# EAGLE design Vulture Controls (EAGLE 6.5.0)

## Sheet 1 of 5: IC - Teensy 3.1
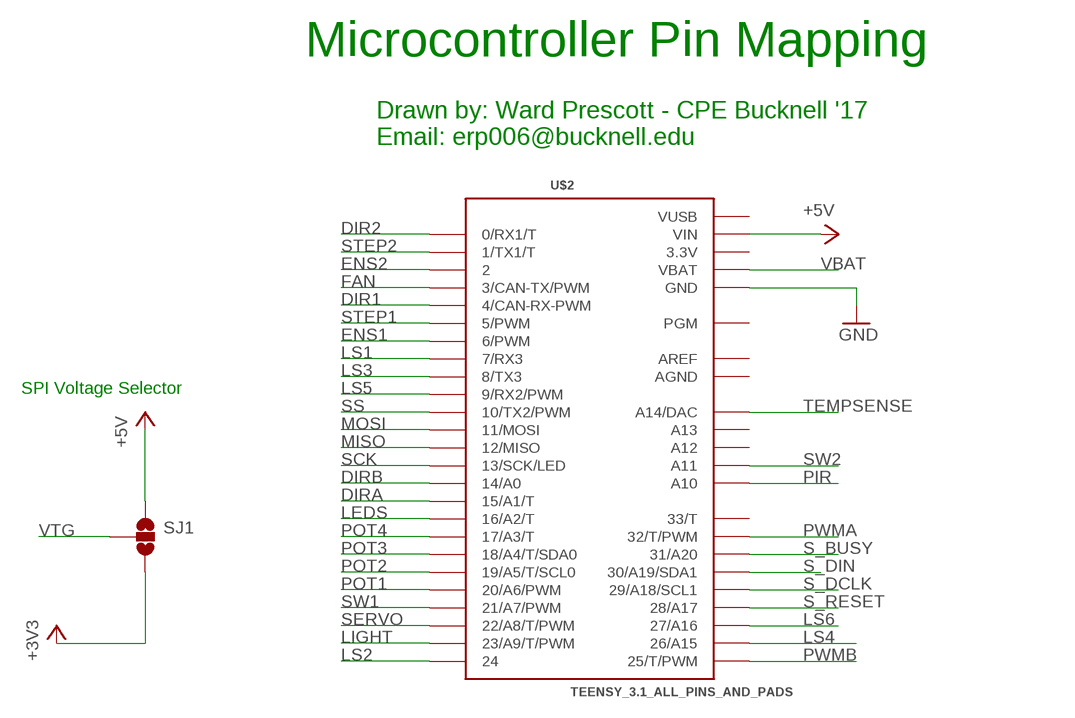
[diagram p0: schematic, sheet 1]

### Parts
SJ1  JUMPER-PAD-3-NOFULL_BOX_SILK  [PAD-JUMPER-3-NO_YES_SILK_FULL_BOX]
U$2  TEENSY_3.1_ALL_PINS_AND_PADS  [TEENSY_3.1_ALLPINS]

### Nets
+3V3: SJ1.3 ; also sheet 2,3,4
+5V: SJ1.1 U$2.VIN ; also sheet 3,4
DIR1: U$2.4(4/CAN-RX-PWM) ; also sheet 2
DIR2: U$2.0(0/RX1/T) ; also sheet 2
DIRA: U$2.15/A1(15/A1/T) ; also sheet 3
DIRB: U$2.14/A0 ; also sheet 3
ENS1: U$2.6(6/PWM) ; also sheet 2
ENS2: U$2.2 ; also sheet 2
FAN: U$2.3(3/CAN-TX/PWM) ; also sheet 4
GND: U$2.GND U$2.GND1(GND) U$2.GND2(GND) ; also sheet 2,3,4,5
LEDS: U$2.16/A2(16/A2/T) ; also sheet 4
LIGHT: U$2.23/A9(23/A9/T/PWM) ; also sheet 4
LS1: U$2.7(7/RX3) ; also sheet 4
LS2: U$2.24 ; also sheet 4
LS3: U$2.8(8/TX3) ; also sheet 4
LS4: U$2.26(26/A15) ; also sheet 4
LS5: U$2.9(9/RX2/PWM) ; also sheet 4
LS6: U$2.27(27/A16) ; also sheet 4
MISO: U$2.12(12/MISO) ; also sheet 4
MOSI: U$2.11(11/MOSI) ; also sheet 4
PIR: U$2.A10 ; also sheet 4
POT1: U$2.20/A6(20/A6/PWM) ; also sheet 4
POT2: U$2.19/A5(19/A5/T/SCL0) ; also sheet 4
POT3: U$2.18/A4(18/A4/T/SDA0) ; also sheet 4
POT4: U$2.17/A3(17/A3/T) ; also sheet 4
PWMA: U$2.32(32/T/PWM) ; also sheet 3
PWMB: U$2.25(25/T/PWM) ; also sheet 3
S_BUSY: U$2.31(31/A20) ; also sheet 4
S_DCLK: U$2.29(29/A18/SCL1) ; also sheet 4
S_DIN: U$2.30(30/A19/SDA1) ; also sheet 4
S_RESET: U$2.28(28/A17) ; also sheet 4
SCK: U$2.13(13/SCK/LED) ; also sheet 4
SERVO: U$2.22/A8(22/A8/T/PWM) ; also sheet 4
SS: U$2.10(10/TX2/PWM) ; also sheet 4
STEP1: U$2.5(5/PWM) ; also sheet 2
STEP2: U$2.1(1/TX1/T) ; also sheet 2
SW1: U$2.21/A7(21/A7/PWM) ; also sheet 4
SW2: U$2.A11 ; also sheet 4
TEMPSENSE: U$2.A14(A14/DAC) ; also sheet 4
VBAT: U$2.VBAT ; also sheet 4
VTG: SJ1.2 ; also sheet 4
Unconnected: U$2.33(33/T) U$2.A12 U$2.A13 U$2.PGM

### Notes on the sheet
- Microcontroller Pin Mapping
- Drawn by: Ward Prescott - CPE Bucknell '17
  Email: erp006@bucknell.edu
- SPI Voltage Selector

## Sheet 2 of 5: Stepper Motor Drive
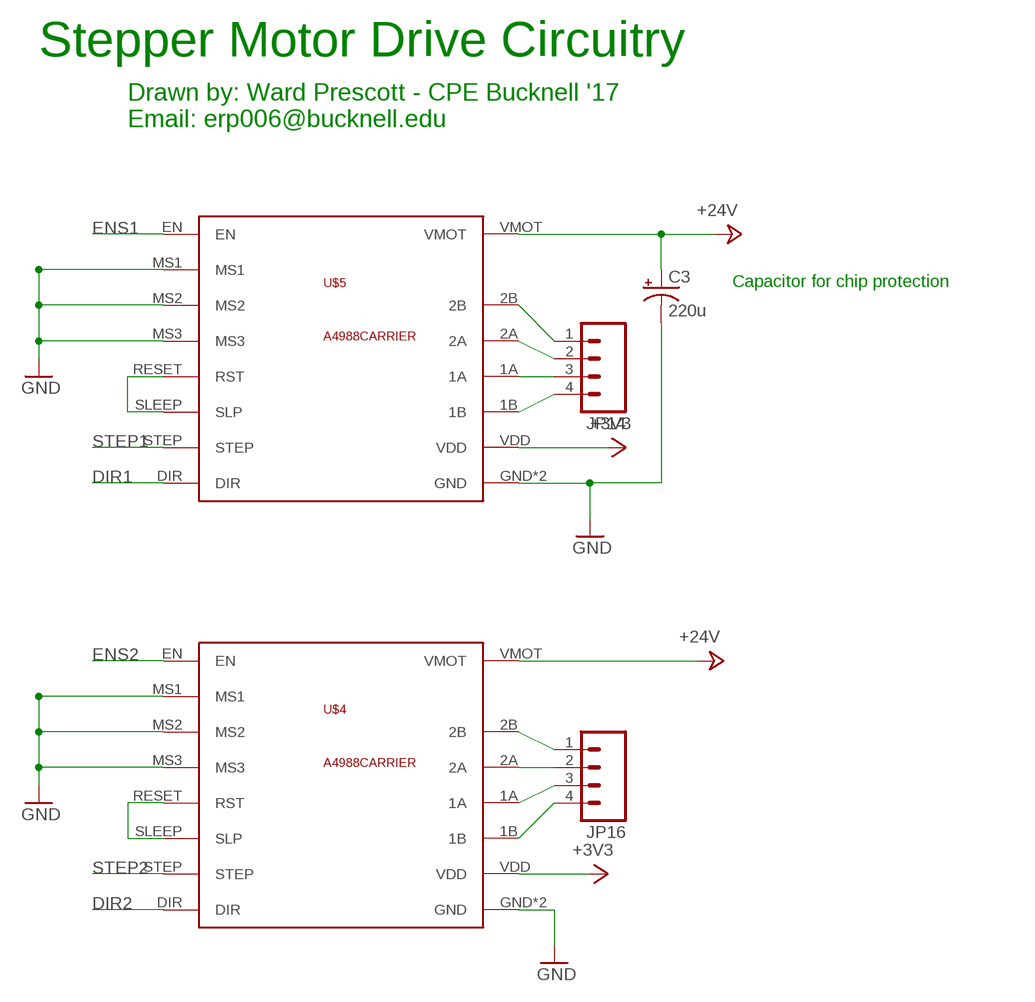
[diagram p1: schematic, sheet 2]

### Parts
C3  220u  CAP_POLPTH4  [CPOL-RADIAL-1000UF-25V]
JP14  M04POLAR_LOCK  [MOLEX-1X4_LOCK]
JP16  M04POLAR_LOCK  [MOLEX-1X4_LOCK]
U$4  A4988CARRIER  [A4988CARRIER]
U$5  A4988CARRIER  [A4988CARRIER]

### Nets
+3V3: U$4.VDD U$5.VDD ; also sheet 1,3,4
+24V: C3.+ U$4.VMOT U$5.VMOT ; also sheet 3,4
DIR1: U$5.DIR ; also sheet 1
DIR2: U$4.DIR ; also sheet 1
ENS1: U$5.EN ; also sheet 1
ENS2: U$4.EN ; also sheet 1
GND: C3.- U$4.GND U$4.GND2(GND) U$4.MS1 U$4.MS2 U$4.MS3 U$5.GND U$5.GND2(GND) U$5.MS1 U$5.MS2 U$5.MS3 ; also sheet 1,3,4,5
N$13: JP14.1 U$5.2B
N$14: JP14.2 U$5.2A
N$15: JP14.3 U$5.1A
N$16: JP14.4 U$5.1B
N$17: JP16.1 U$4.2B
N$18: JP16.2 U$4.2A
N$19: JP16.3 U$4.1A
N$20: JP16.4 U$4.1B
N$23: U$5.RESET(RST) U$5.SLEEP(SLP)
N$24: U$4.RESET(RST) U$4.SLEEP(SLP)
STEP1: U$5.STEP ; also sheet 1
STEP2: U$4.STEP ; also sheet 1

### Notes on the sheet
- Stepper Motor Drive Circuitry
- Drawn by: Ward Prescott - CPE Bucknell '17
  Email: erp006@bucknell.edu
- Capacitor for chip protection

## Sheet 3 of 5: DC Motor Control
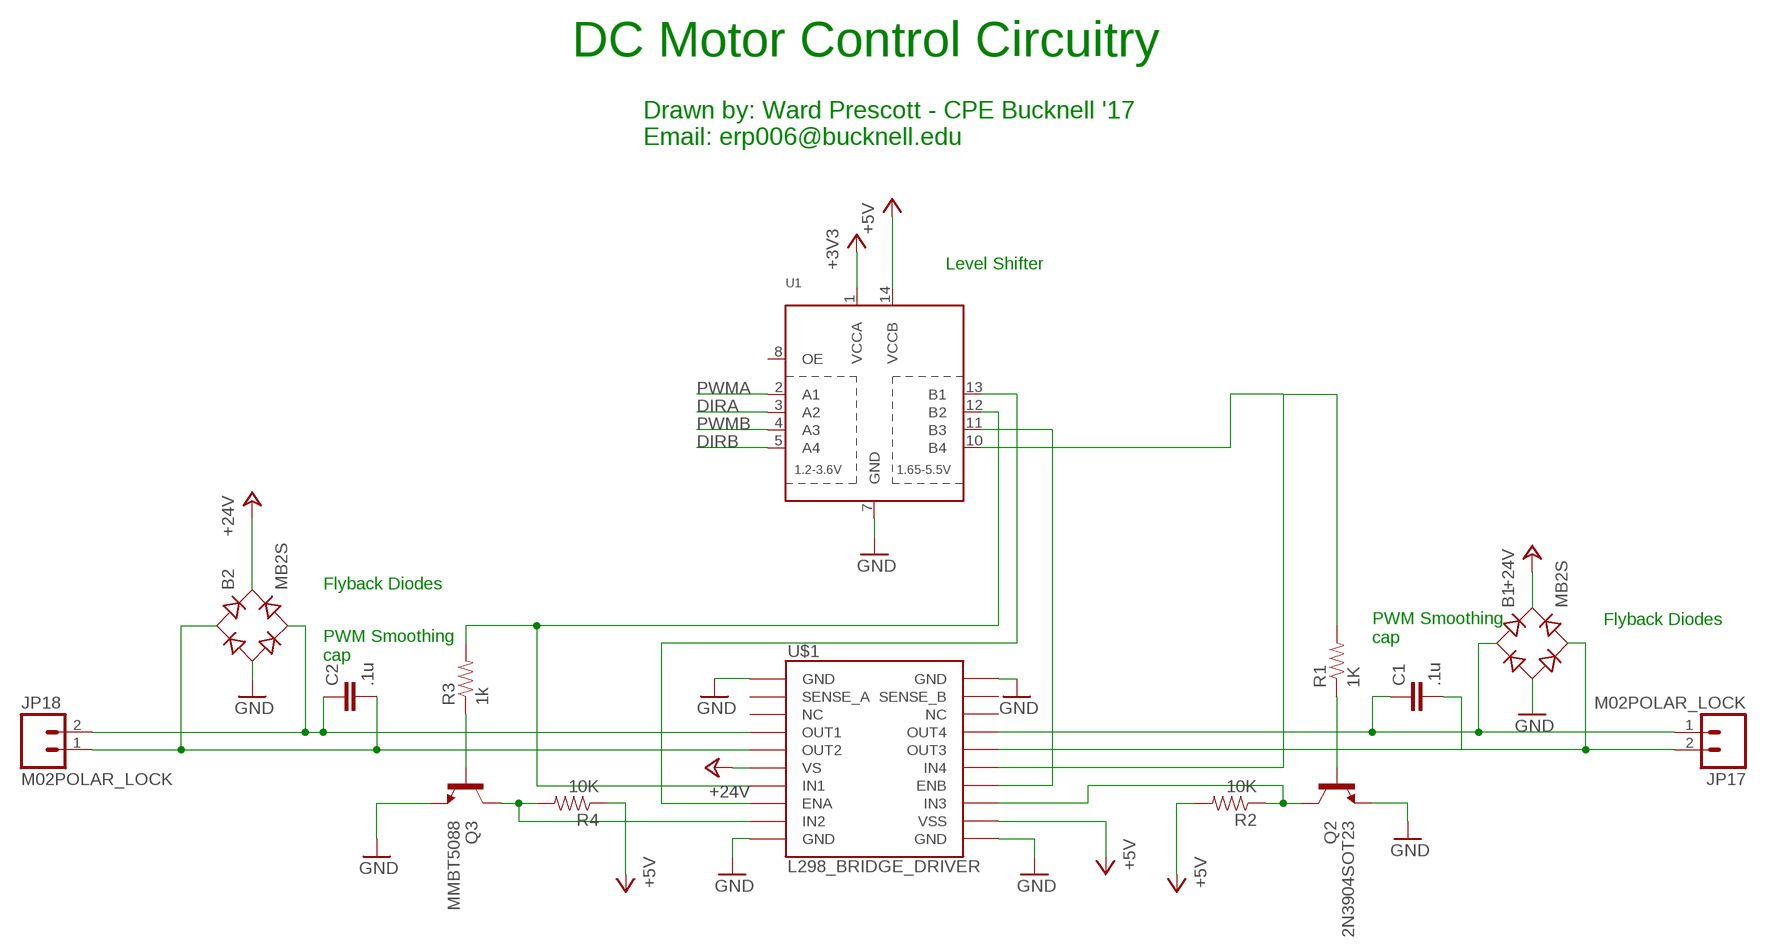
[diagram p2: schematic, sheet 3]

### Parts
B1  MB2S  [SOIC-4]
B2  MB2S  [SOIC-4]
C1  .1u  CAP1210  [1210]
C2  .1u  CAP1210  [1210]
JP17  M02POLAR_LOCK  [MOLEX-1X2_LOCK]
JP18  M02POLAR_LOCK  [MOLEX-1X2_LOCK]
Q2  2N3904SOT23  TRANSISTOR_NPNMMBT5088  [SOT23]
Q3  MMBT5088  TRANSISTOR_NPNMMBT5088  [SOT23]
R1  1K  RESISTOR0805-RES  [0805]
R2  10K  RESISTOR0603  [0603-RES]
R3  1k  RESISTOR0805-RES  [0805]
R4  10K  RESISTOR0603  [0603-RES]
U1  TXB0104PWRSOIC14  [SO14]
U$1  L298_BRIDGE_DRIVER  [POWERSO20]

### Nets
+3V3: U1.1(VCCA) ; also sheet 1,2,4
+5V: R2.2 R4.1 U1.14(VCCB) U$1.12(VSS) ; also sheet 1,4
+24V: B1.+ B2.+ U$1.6(VS) ; also sheet 2,4
DIRA: U1.3(A2) ; also sheet 1
DIRB: U1.5(A4) ; also sheet 1
GND: B1.- B2.- Q2.2(E) Q3.2(E) U1.7(GND) U$1.1(GND) U$1.10(GND) U$1.11(GND) U$1.20(GND) U$1.P$1(GND) ; also sheet 1,2,4,5
N$1: B2.~2(AC2) C2.1 JP18.2 U$1.4(OUT1)
N$2: B2.~1(AC1) C2.2 JP18.1 U$1.5(OUT2)
N$3: B1.~1(AC1) C1.1 JP17.1 U$1.17(OUT4)
N$4: B1.~2(AC2) C1.2 JP17.2 U$1.16(OUT3)
N$5: U1.11(B3) U$1.14(ENB)
N$6: R1.2 U1.10(B4) U$1.15(IN4)
N$7: U1.13(B1) U$1.8(ENA)
N$8: R3.2 U1.12(B2) U$1.7(IN1)
N$9: Q2.1(B) R1.1
N$10: Q2.3(C) R2.1 U$1.13(IN3)
N$11: Q3.1(B) R3.1
N$12: Q3.3(C) R4.2 U$1.9(IN2)
PWMA: U1.2(A1) ; also sheet 1
PWMB: U1.4(A3) ; also sheet 1
Unconnected: U1.8(OE) U$1.2(SENSE_A) U$1.3(NC) U$1.18(NC) U$1.19(SENSE_B)

### Notes on the sheet
- DC Motor Control Circuitry
- Drawn by: Ward Prescott - CPE Bucknell '17
  Email: erp006@bucknell.edu
- Level Shifter
- Flyback Diodes
- Flyback Diodes
- PWM Smoothing
  cap
- PWM Smoothing
  cap

## Sheet 4 of 5: Other Peripherals
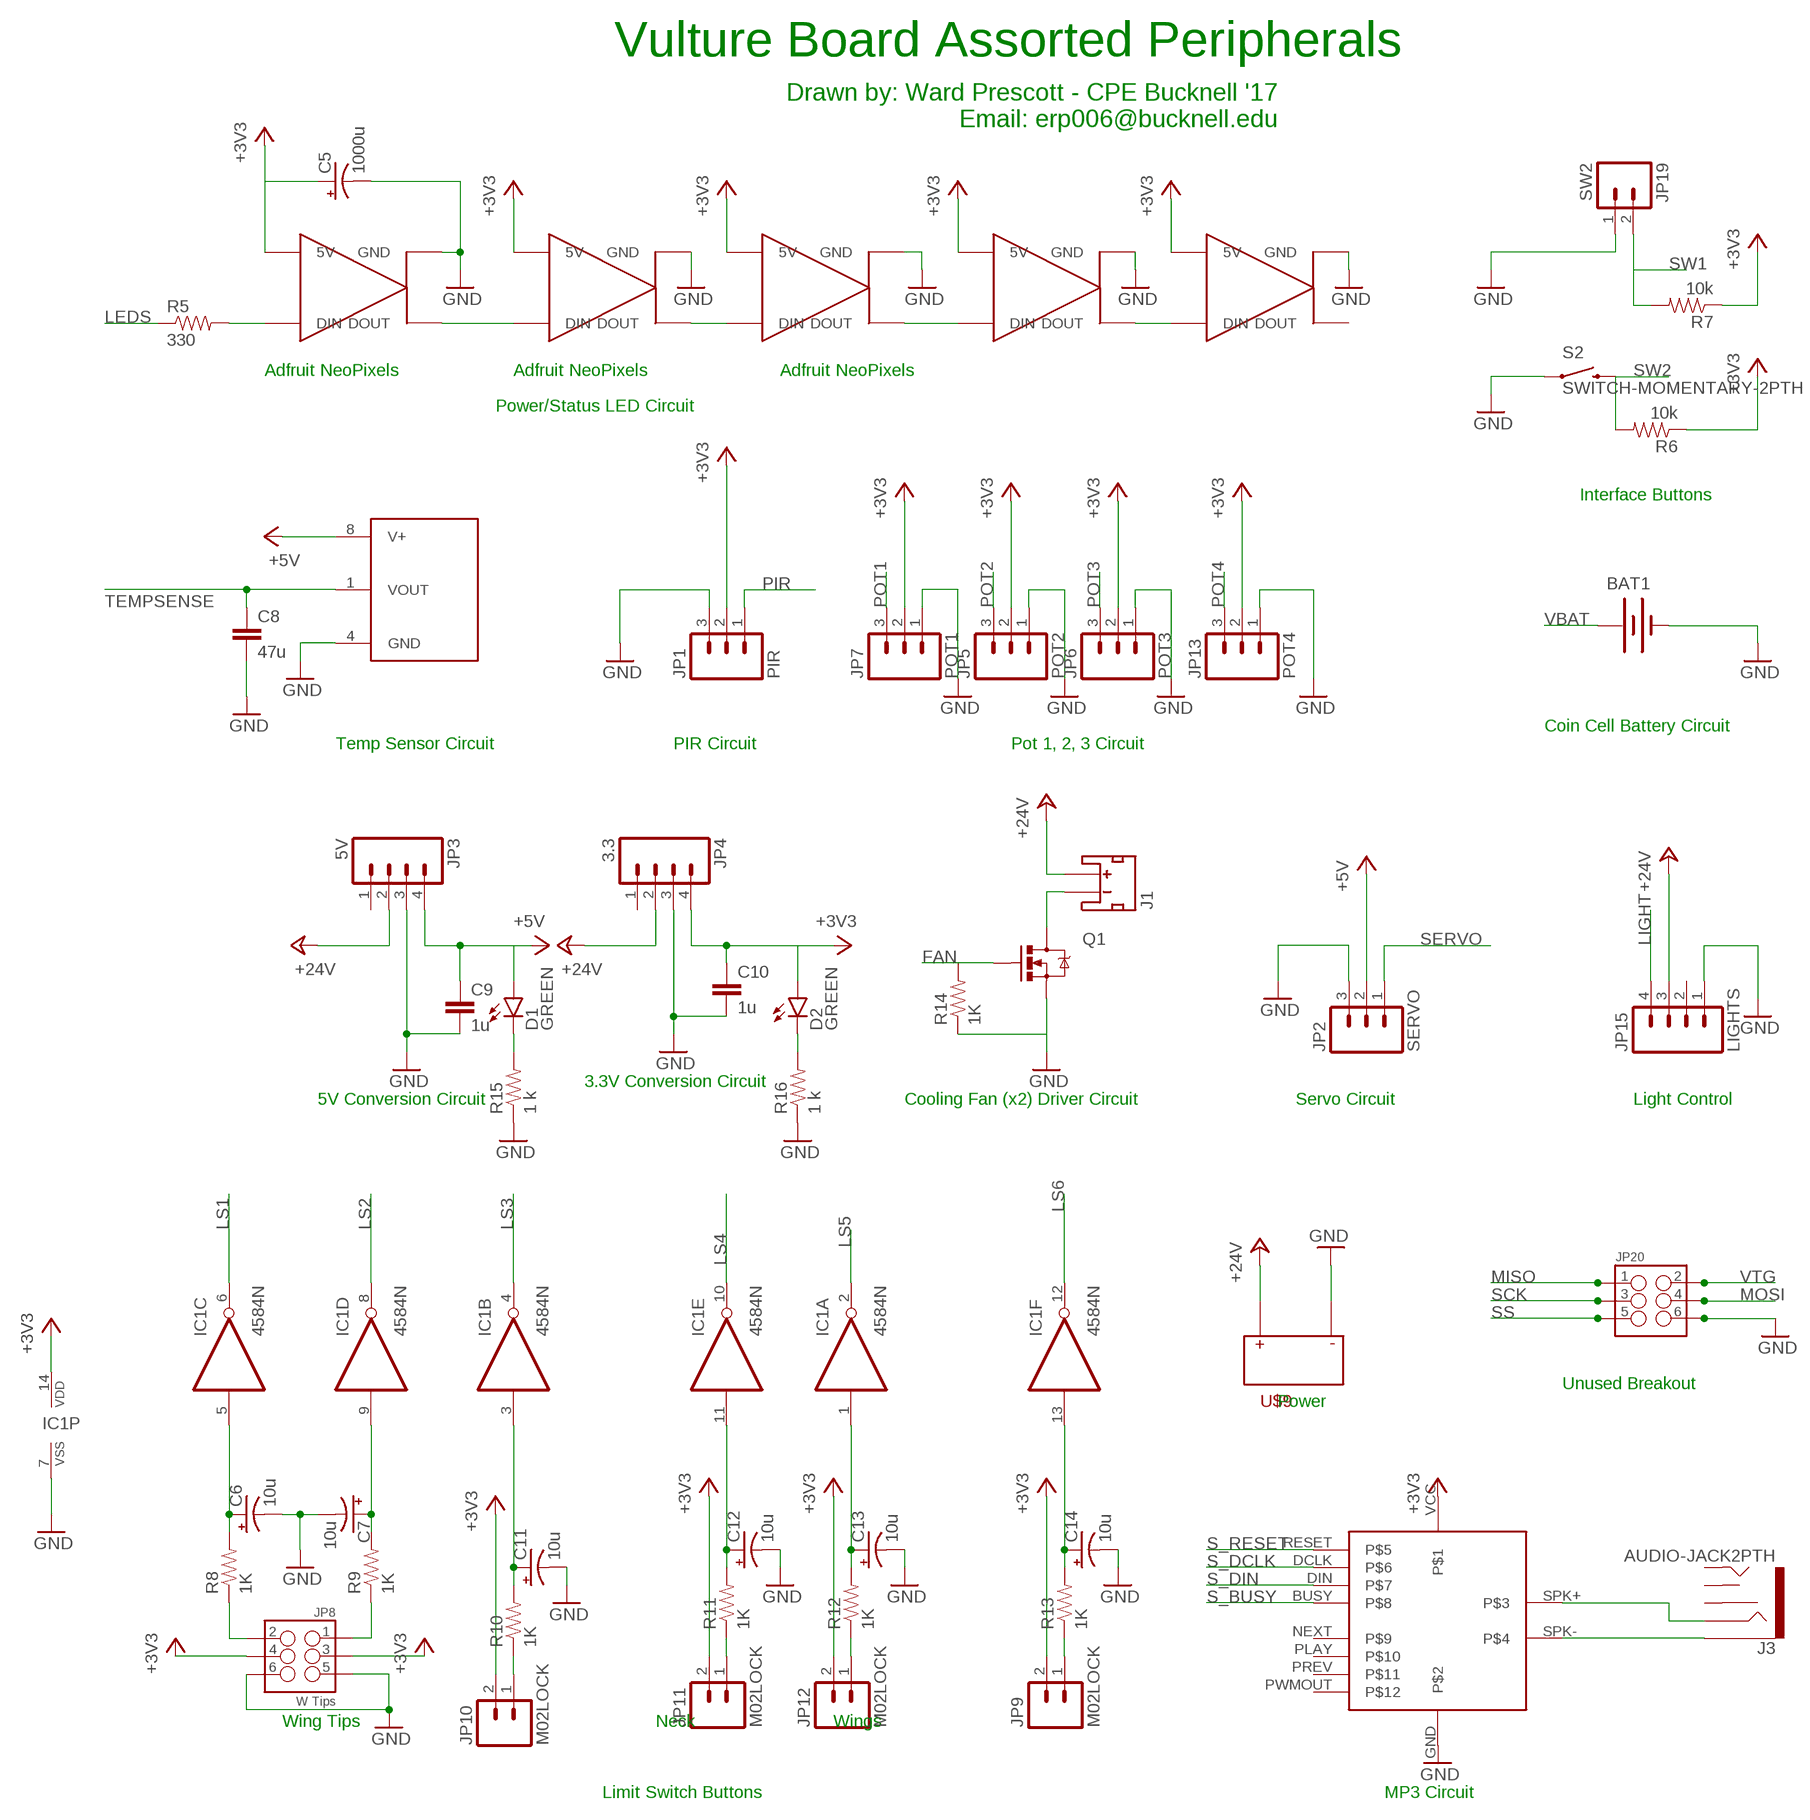
[diagram p3: schematic, sheet 4]

### Parts
BAT1  BATTERY20PTH  [BATTCOM_20MM_PTH]
C5  1000u  CAP_POLG  [PANASONIC_G]
C6  10u  CAP_POLC  [PANASONIC_C]
C7  10u  CAP_POLC  [PANASONIC_C]
C8  47u  CAP1206  [1206]
C9  1u  CAP1206  [1206]
C10  1u  CAP1206  [1206]
C11  10u  CAP_POLC  [PANASONIC_C]
C12  10u  CAP_POLC  [PANASONIC_C]
C13  10u  CAP_POLC  [PANASONIC_C]
C14  10u  CAP_POLC  [PANASONIC_C]
D1  GREEN  LED-GREENLARGE  [LED-1206]
D2  GREEN  LED-GREENLARGE  [LED-1206]
IC1  4584N  [DIL14]
J1  JST_2MM_MALE  [JST-2-SMD]
J3  AUDIO-JACK2PTH  [AUDIO-JACK]
JP1  PIR  M03LOCK_LONGPADS  [1X03_LOCK_LONGPADS]
JP2  SERVO  M03LOCK_LONGPADS  [1X03_LOCK_LONGPADS]
JP3  5V  M04LOCK  [1X04_LOCK]
JP4  3.3  M04LOCK  [1X04_LOCK]
JP5  POT2  M03LOCK_LONGPADS  [1X03_LOCK_LONGPADS]
JP6  POT3  M03LOCK_LONGPADS  [1X03_LOCK_LONGPADS]
JP7  POT1  M03LOCK_LONGPADS  [1X03_LOCK_LONGPADS]
JP8  W Tips  M03X2POGO_PINS  [2X3_POGO]
JP9  M02LOCK  [1X02_LOCK]
JP10  M02LOCK  [1X02_LOCK]
JP11  M02LOCK  [1X02_LOCK]
JP12  M02LOCK  [1X02_LOCK]
JP13  POT4  M03LOCK_LONGPADS  [1X03_LOCK_LONGPADS]
JP15  LIGHTS  M04POLAR_LOCK  [MOLEX-1X4_LOCK]
JP19  SW2  M02LOCK  [1X02_LOCK]
JP20  M03X2POGO_PINS  [2X3_POGO]
Q1  SSM3K329R,LF  MOSFET-NCHANNEL2N7002PW  [SOT323]
R5  330  RESISTOR0603  [0603-RES]
R6  10k  RESISTOR0603  [0603-RES]
R7  10k  RESISTOR0603  [0603-RES]
R8  1K  RESISTOR0805-RES  [0805]
R9  1K  RESISTOR0805-RES  [0805]
R10  1K  RESISTOR0805-RES  [0805]
R11  1K  RESISTOR0805-RES  [0805]
R12  1K  RESISTOR0805-RES  [0805]
R13  1K  RESISTOR0805-RES  [0805]
R14  1K  RESISTOR0805-RES  [0805]
R15  1 k  RESISTOR0805-RES  [0805]
R16  1 k  RESISTOR0805-RES  [0805]
S2  SWITCH-MOMENTARY-2PTH  [TACTILE-PTH]
U$3  LM34  [SO08]
U$6  NEOPIXEL_THT  [NEOPIXEL_THT]
U$7  NEOPIXEL_THT  [NEOPIXEL_THT]
U$8  NEOPIXEL_THT  [NEOPIXEL_THT]
U$9  CONN_HDR_2POS_7.5MM_R/A_SLDR  [MOLEXPOWER]
U$10  NEOPIXEL_THT  [NEOPIXEL_THT]
U$11  NEOPIXEL_THT  [NEOPIXEL_THT]
U$12  WTV020SD-BRKOUT  [WTVO20SD-BRKKOUT]

### Nets
+3V3: C5.+ C10.1 D2.A IC1.14(P:VDD) JP1.2 JP4.4 JP5.2 JP6.2 JP7.2 JP8.P$3 JP8.P$4 JP9.2 JP10.2 JP11.2 JP12.2 JP13.2 R6.1 R7.1 U$6.5V U$7.5V U$8.5V U$10.5V U$11.5V U$12.VCC ; also sheet 1,2,3
+5V: C9.1 D1.A JP2.2 JP3.4 U$3.8(V+) ; also sheet 1,3
+24V: J1.2(+) JP3.2 JP4.2 JP15.3 U$9.P$1 U$9.P$2 ; also sheet 2,3
FAN: Q1.1(G) R14.2 ; also sheet 1
GND: BAT1.2(-) C5.- C6.- C7.- C8.2 C9.2 C10.2 C11.- C12.- C13.- C14.- IC1.7(P:VSS) JP1.3 JP2.3 JP3.3 JP4.3 JP5.1 JP6.1 JP7.1 JP8.P$5 JP8.P$6 JP13.1 JP15.1 JP19.1 JP20.P$6 Q1.2(S) R14.1 R15.1 R16.1 S2.1 U$3.4(GND) U$6.GND U$7.GND U$8.GND U$9.P$3 U$9.P$4 U$10.GND U$11.GND U$12.GND ; also sheet 1,2,3,5
LEDS: R5.1 ; also sheet 1
LIGHT: JP15.4 ; also sheet 1
LS1: IC1.6(C:O) ; also sheet 1
LS2: IC1.8(D:O) ; also sheet 1
LS3: IC1.4(B:O) ; also sheet 1
LS4: IC1.10(E:O) ; also sheet 1
LS5: IC1.2(A:O) ; also sheet 1
LS6: IC1.12(F:O) ; also sheet 1
MISO: JP20.P$1 ; also sheet 1
MOSI: JP20.P$4 ; also sheet 1
N1: C6.+ IC1.5(C:I) R8.2
N2: C7.+ IC1.9(D:I) R9.2
N3: C11.+ IC1.3(B:I) R10.2
N5: C13.+ IC1.1(A:I) R12.2
N6: C14.+ IC1.13(F:I) R13.2
N$21: C12.+ IC1.11(E:I) R11.2
N$22: JP10.1 R10.1
N$25: JP11.1 R11.1
N$27: JP12.1 R12.1
N$29: U$6.DOUT U$7.DIN
N$30: U$8.DOUT U$10.DIN
N$31: R5.2 U$6.DIN
N$32: U$7.DOUT U$8.DIN
N$33: J1.1(-) Q1.3(D)
N$34: JP8.P$2 R8.1
N$35: JP8.P$1 R9.1
N$36: JP9.1 R13.1
N$38: U$10.DOUT U$11.DIN
N$39: J3.SLEEVE U$12.SPK-
N$40: J3.RING U$12.SPK+
N$49: D1.C R15.2
N$50: D2.C R16.2
PIR: JP1.1 ; also sheet 1
POT1: JP7.3 ; also sheet 1
POT2: JP5.3 ; also sheet 1
POT3: JP6.3 ; also sheet 1
POT4: JP13.3 ; also sheet 1
S_BUSY: U$12.BUSY ; also sheet 1
S_DCLK: U$12.DCLK ; also sheet 1
S_DIN: U$12.DIN ; also sheet 1
S_RESET: U$12.RESET ; also sheet 1
SCK: JP20.P$3 ; also sheet 1
SERVO: JP2.1 ; also sheet 1
SS: JP20.P$5 ; also sheet 1
SW1: JP19.2 R7.2 ; also sheet 1
SW2: R6.2 S2.3 ; also sheet 1
TEMPSENSE: C8.1 U$3.1(VOUT) ; also sheet 1
VBAT: BAT1.1(+) ; also sheet 1
VTG: JP20.P$2 ; also sheet 1
Unconnected: J1.NC1(PAD1) J1.NC2(PAD2) J3.RSH J3.TIP J3.TSH JP3.1 JP4.1 JP15.2 U$11.DOUT U$12.NEXT U$12.PLAY U$12.PREV U$12.PWMOUT

### Notes on the sheet
- Vulture Board Assorted Peripherals
- Drawn by: Ward Prescott - CPE Bucknell '17
  Email: erp006@bucknell.edu
- Adfruit NeoPixels | Adfruit NeoPixels | Adfruit NeoPixels
- Power/Status LED Circuit
- Interface Buttons
- Coin Cell Battery Circuit
- Temp Sensor Circuit | PIR Circuit | Pot 1, 2, 3 Circuit
- 3.3V Conversion Circuit
- 5V Conversion Circuit | Cooling Fan (x2) Driver Circuit | Servo Circuit | Light Control
- Unused Breakout
- Power
- Wing Tips | Neck | Wings
- Limit Switch Buttons | MP3 Circuit

## Sheet 5 of 5: Holes and Misc.
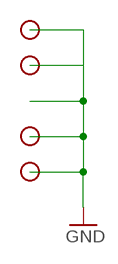
[diagram p4: schematic, sheet 5]

### Parts
STANDOFF1  STAND-OFF  [STAND-OFF]
STANDOFF2  STAND-OFF  [STAND-OFF]
STANDOFF4  STAND-OFF  [STAND-OFF]
STANDOFF6  STAND-OFF  [STAND-OFF]

## Power pins joined to a net without a drawn wire
3.3V: U$2.3.3V U$2.3.3V1(3.3V) U$2.3.3V2(3.3V)
AGND: U$2.AGND
AREF: U$2.AREF
VUSB: U$2.VUSB

## Library data of the parts
B1 B2 = rectifier:MB*S: Bridge Rectifier Source: http://www.fairchildsemi.com/ds/MB/MB6S.pdf
BAT1 = SparkFun-Electromechanical:BATTERY: Battery Holders Various common sizes : AA, AAA, 20mm coin cell and 12mm coin cell. 20MM_4LEGS, BATT-10373
C1 C2 C8-C10 = SparkFun-Capacitors:CAP: Capacitor Standard 0603 ceramic capacitor, and 0.1" leaded capacitor.
C3 C5-C7 C11-C14 = SparkFun-Capacitors:CAP_POL: Capacitor Polarized These are standard SMD and PTH capacitors. Normally 10uF, 47uF, and 100uF in electrolytic and tantalum varieties. Always verify the external diameter of the through hole cap, it varies with capacity, voltage, and manufacturer. The EIA devices should be standard.
D1 D2 = SparkFun-LED:LED-GREEN: Various green LEDs Green LEDs used in SFE Production 0603- DIO-00821 LARGE- DIO-00862 LILYPAD- DIO-09910; PROD_ID: DIO-00862
IC1 = 45xx:4584: Hex SCHMITT TRIGGER (74C14)
J1 = SparkFun-Connectors:JST_2MM_MALE: Mates to single-cell LiPo batteries. CONN-08352; PROD_ID: CONN-08352
J3 = SparkFun-Connectors:AUDIO-JACK2: Stereo audio jack with bypass switches. SMT version used on LilyPad MP3 board.; PROD_ID: CONN-08774
JP1 JP2 JP5-JP7 JP13 = SparkFun-Connectors:M03: Header 3 Standard 3-pin 0.1" header. Use with straight break away headers (SKU : PRT-00116), right angle break away headers (PRT-00553), swiss pins (PRT-00743), machine pins (PRT-00117), and female headers (PRT-00115). Molex polarized connector foot print use with SKU : PRT-08232 with associated crimp pins and housings.
JP3 JP4 JP14-JP16 = SparkFun-Connectors:M04: Header 4 Standard 4-pin 0.1" header. Use with straight break away headers (SKU : PRT-00116), right angle break away headers (PRT-00553), swiss pins (PRT-00743), machine pins (PRT-00117), and female headers (PRT-00115). Molex polarized connector foot print use with SKU : PRT-08231 with associated crimp pins and housings. 1MM SMD Version SKU: PRT-10208
JP8 JP20 = SparkFun-Connectors:M03X2: 2x3 .1" header. Shrouded, with keying- CONN-10681 SMT- CONN-11415 Pogo pins- HW-11044; PROD_ID: HW-11044
JP9-JP12 JP17-JP19 = SparkFun-Connectors:M02: Standard 2-pin 0.1" header. Use with - straight break away headers ( PRT-00116) - right angle break away headers (PRT-00553) - swiss pins (PRT-00743) - machine pins (PRT-00117) - female headers (PRT-00115) Molex polarized connector foot print use with: PRT-08233 with associated crimp pins and housings. 2.54_SCREWTERM for use with PRT-10571. 3.5mm Screw Terminal footprints for PRT-08084 5mm Screw Terminal footprints for use with PRT-08432
Q1 = SparkFun-DiscreteSemi:MOSFET-NCHANNEL: Common NMOSFET Parts MFG P/N Store ID Prod ID FDD8780 TRANS-09984 SI7820DN TRANS-11055 FDS6630A IC-08089 2N7002PW TRANS-11151 FQP30N06L COM-10213 TRANS-10060 BSS123LT1G TRANS-08345 BSS138 TRANS-00830 BS170 2N7000; PROD_ID: TRANS-11151
Q2 = SparkFun-DiscreteSemi:TRANSISTOR_NPN: Generic NPN BJT MMBT2222A - TRANS-08049 (SOT-23, 1A 40V) MPSA42 - TRANS-09116 (SOT-23, 500mA 300V) MMBT5088LT1G - TRANS-11160 (SOT-23, 50 mA 30V) BC547 - COM-08928 <http://www.sparkfun.com/products/8928> (TO-92 45V 100mA) (1.Collector 2.Base 3.Emitter) 2N3904 - COM-00521 <http://www.sparkfun.com/products/521> (TO-92 40V 200mA) (1.Emitter 2.Base 3.Collector) P2N2222A - COM-12852 <http://www.sparkfun.com/products/12852> (TO-92 40V 600mA) (1.Collector 2.Base 3.Emitter); PROD_ID: TRANS-11160; VALUE: MMBT5088
Q3 = SparkFun-DiscreteSemi:TRANSISTOR_NPN: Generic NPN BJT MMBT2222A - TRANS-08049 (SOT-23, 1A 40V) MPSA42 - TRANS-09116 (SOT-23, 500mA 300V) MMBT5088LT1G - TRANS-11160 (SOT-23, 50 mA 30V) BC547 - COM-08928 <http://www.sparkfun.com/products/8928> (TO-92 45V 100mA) (1.Collector 2.Base 3.Emitter) 2N3904 - COM-00521 <http://www.sparkfun.com/products/521> (TO-92 40V 200mA) (1.Emitter 2.Base 3.Collector) P2N2222A - COM-12852 <http://www.sparkfun.com/products/12852> (TO-92 40V 600mA) (1.Collector 2.Base 3.Emitter); PROD_ID: TRANS-11160
R1-R16 = SparkFun-Resistors:RESISTOR: Resistor Basic schematic elements and footprints for 0603, 1206, and PTH resistors.
S2 = SparkFun-Electromechanical:SWITCH-MOMENTARY-2: Various NO switches- pushbuttons, reed, etc
SJ1 = SparkFun-Passives:JUMPER-PAD-3-NO
STANDOFF1 STANDOFF2 STANDOFF4 STANDOFF6 = SparkFun-Electromechanical:STAND-OFF: #4 Stand Off This is the mechanical footprint for a #4 phillips button head screw. Use the keepout ring to avoid running the screw head into surrounding components. SKU : PRT-00447
U1 = SparkFun-DigitalIC:TXB0104PWR: 4-Bit Bi-Directional Level Shifter 1.2V-3.6V (VCCA) to 1.65V-5.5V (VCCB) bi-directional level shifter with auto direction sensing. Max data rate - VCCA 1.8V: 20Mbps (50ns), VCCA 3.3V: 100Mbps (10ns) Digikey: 296-21929-1-ND (TSSOP) IC-11329; PROD_ID: IC-11329
U$1 = SparkFun-PowerIC:L298_BRIDGE_DRIVER: Full-bridge power driver IC
U$2 = Teensy_3_Series_Board_v1.0:TEENSY_3.1_ALL_PINS_AND_PADS: Footprint for Teensy 3.1 board using all pads and all through-holes. Pads need a 2x7 0.1" SMD header.
U$3 = SparkFun-Sensors:LM34: 10mV/degF, 1 degF accurate analog temp sensor
U$4 U$5 = Ward Custom:A4988CARRIER
U$6-U$8 U$10 U$11 = Ward Custom:NEOPIXEL_THT
U$9 = Ward Custom:CONN_HDR_2POS_7.5MM_R/A_SLDR
U$12 = Ward Custom:WTV020SD-BRKOUT

## Board
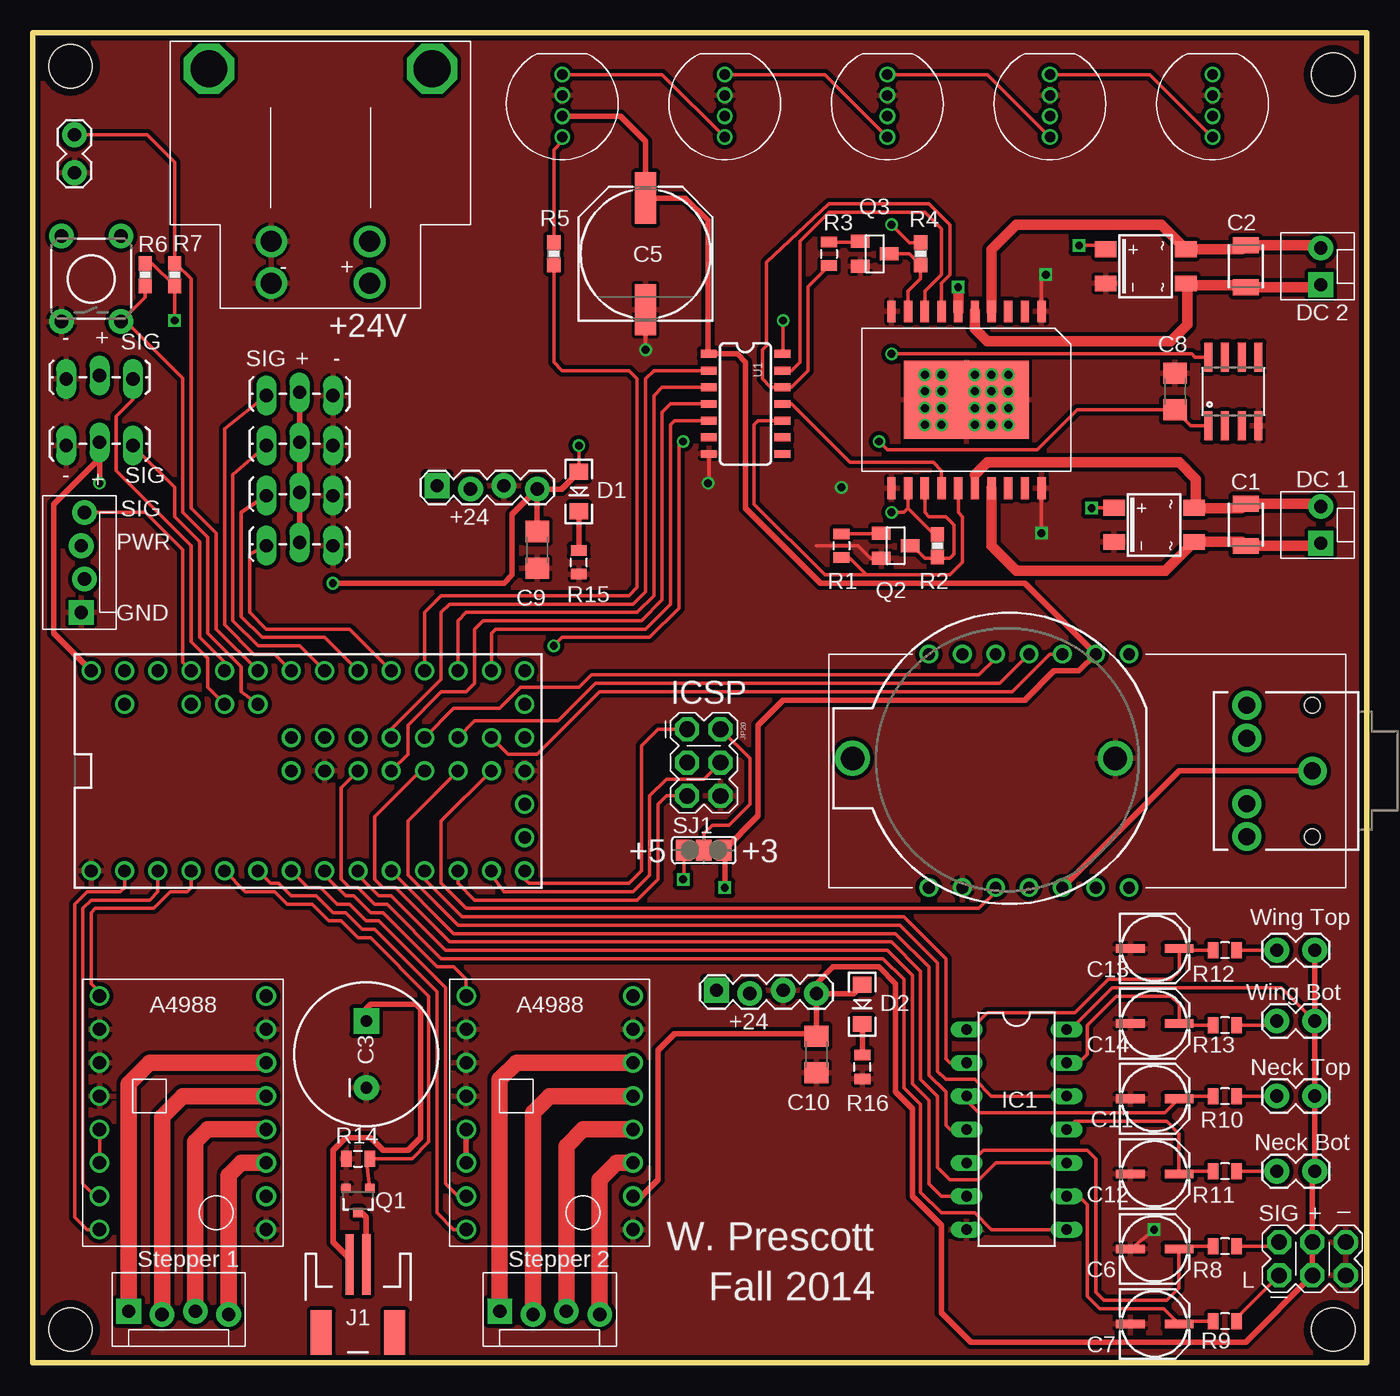
[diagram p5: board, top side]
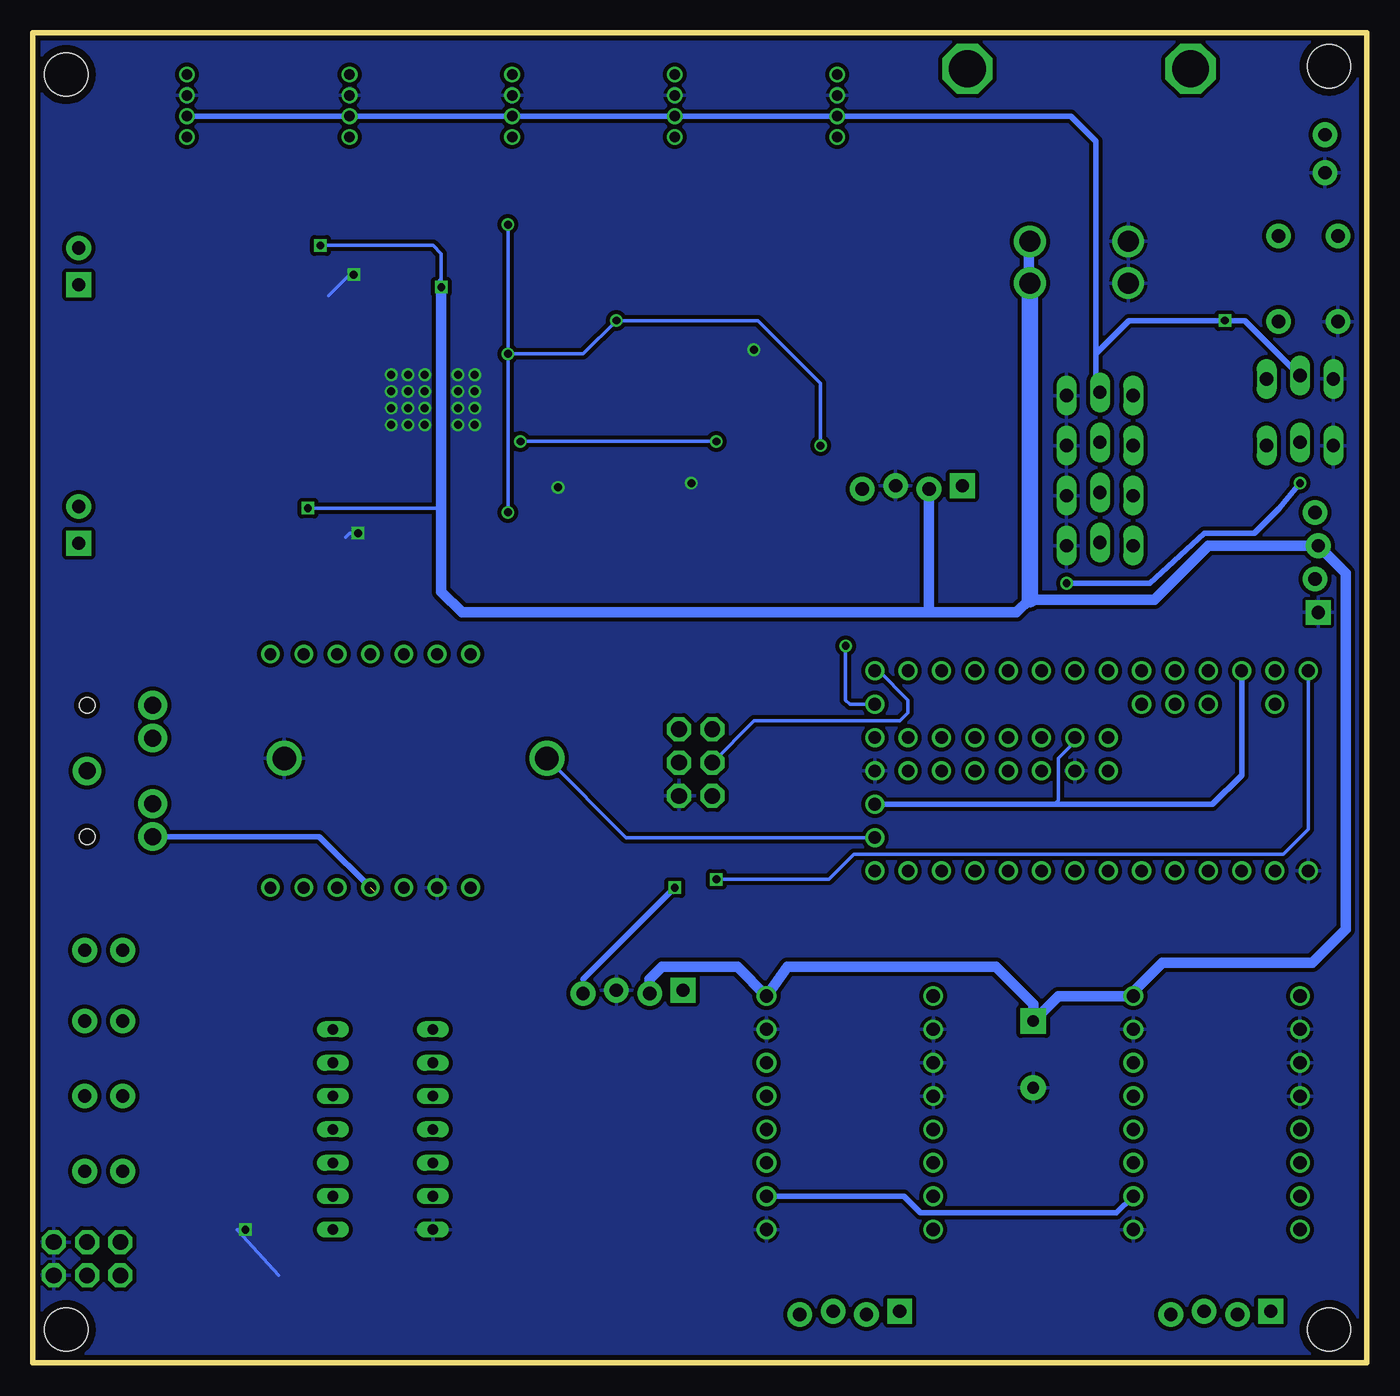
[diagram p6: board, bottom side, seen from below]

Size 101.6 x 101.28 mm. Coordinates in mm from the lower left corner, seen from the top.
Outline: 0,0 101.6,0 101.6,101.28 0,101.28 0,0
Copper layers (1*16): Top 0.0356mm / dielectric 1.5011mm / Bottom 0.0356mm
Design rules "OSHParkRules": minimum track width 6mil, minimum drill 13mil, track to track 6mil, track to pad 6mil, pad to pad 6mil, via to via 6mil, smd to smd 6mil, copper to edge 15mil, drill to drill 6mil, minimum pad ring 7mil, minimum via ring 7mil, stop-mask expansion 3mil, vias tented up to drill 0mil, thermal gap 10mil

### Footprints (pad centres in the part's own frame; a part is rotated, then mirrored left to right if it is on the bottom)
SOIC-4 = smd 1.2 x 1.651: + 1.3,3.05; - -1.3,3.05; ~1 -1.3,-3.05; ~2 1.3,-3.05
BATTCOM_20MM_PTH = drill 1.778: 1 11.85,0; 2 -8.15,0
1210 = smd 1.2 x 2: 1 -1.6,0; 2 1.6,0
CPOL-RADIAL-1000UF-25V = drill 0.9 pad 1.93 square: + 2.54,0 | drill 0.9 pad 1.93: - -2.54,0
PANASONIC_G = smd 3.9 x 1.6: + 4.25,0; - -4.25,0
PANASONIC_C = smd 2.2 x 0.65: + 1.9,-0.2; - -1.8,-0.2
1206 = smd 1.6 x 1.8: 1 -1.4,0; 2 1.4,0
LED-1206 = smd 1.2 x 1.4: A -1.5,0; C 1.5,0
DIL14 = drill 0.813 long: 1 -7.62,-3.81; 2 -5.08,-3.81; 3 -2.54,-3.81; 4 0,-3.81; 5 2.54,-3.81; 6 5.08,-3.81; 7 7.62,-3.81; 8 7.62,3.81; 9 5.08,3.81; 10 2.54,3.81; 11 0,3.81; 12 -2.54,3.81; 13 -5.08,3.81; 14 -7.62,3.81
JST-2-SMD = smd 0.635 x 4.6: 1 -0.635,-3.7; 2 0.635,-3.7 | smd 1.6 x 3.4: NC1 -2.794,1.5; NC2 2.794,1.5
AUDIO-JACK = drill 1.3 pad 2.184: RING 5,5; RSH 5,2.5; SLEEVE 0,0; TIP 5,-5; TSH 5,-2.5 | hole 1.2: 0,5; 0,-5
1X03_LOCK_LONGPADS = drill 1.016 long: 1 0,0; 2 2.54,-0.254; 3 5.08,0
1X04_LOCK = drill 1.016 pad 1.88 square: 1 0,0.127 | drill 1.016 pad 1.88: 2 2.54,-0.127; 3 5.08,0.127; 4 7.62,-0.127
2X3_POGO = drill 1.2 pad 1.829 octagon: P$1 0,0; P$2 0,2.54; P$3 2.54,0; P$4 2.54,2.54; P$5 5.08,0; P$6 5.08,2.54
1X02_LOCK = drill 1.016 pad 1.88: 1 -0.178,0; 2 2.718,0
MOLEX-1X4_LOCK = drill 1.016 pad 1.88 square: 1 0,0.127 | drill 1.016 pad 1.88: 2 2.54,-0.127; 3 5.08,0.127; 4 7.62,-0.127
MOLEX-1X2_LOCK = drill 1.016 pad 1.88 square: 1 -0.127,0 | drill 1.016 pad 1.88: 2 2.667,0
SOT323 = smd 0.7 x 0.7: 1 -0.904,-0.925; 2 0.904,-0.925; 3 0,0.925
SOT23 = smd 1 x 1.4: 1 -0.95,-1.1; 2 0.95,-1.1; 3 0,1.1
0805 = smd 0.8 x 1.2: 1 -0.9,0; 2 0.9,0
0603-RES = smd 1.1 x 1: 1 -0.85,0; 2 0.85,0
TACTILE-PTH = drill 1.016 pad 1.88: 1 -3.251,2.261; 2 3.251,2.261; 3 -3.251,-2.261; 4 3.251,-2.261
PAD-JUMPER-3-NO_YES_SILK_FULL_BOX = smd 1.168 x 1.6: 1 -1.524,0; 2 0,0; 3 1.524,0
STAND-OFF = hole 3.302: 0,0
SO14 = smd 0.6 x 1.2: 1 -3.81,-2.8; 2 -2.54,-2.8; 3 -1.27,-2.8; 4 0,-2.8; 5 1.27,-2.8; 6 2.54,-2.8; 7 3.81,-2.8; 8 3.81,2.8; 9 2.54,2.8; 10 1.27,2.8; 11 0,2.8; 12 -1.27,2.8; 13 -2.54,2.8; 14 -3.81,2.8
POWERSO20 = smd 1.651 x 0.635: 1 -6.731,5.715; 2 -6.731,4.445; 3 -6.731,3.175; 4 -6.731,1.905; 5 -6.731,0.635; 6 -6.731,-0.635; 7 -6.731,-1.905; 8 -6.731,-3.175; 9 -6.731,-4.445; 10 -6.731,-5.715; 11 6.731,-5.715; 12 6.731,-4.445; 13 6.731,-3.175; 14 6.731,-1.905; 15 6.731,-0.635; 16 6.731,0.635; 17 6.731,1.905; 18 6.731,3.175; 19 6.731,4.445; 20 6.731,5.715 | smd 5.969 x 9.525: P$1 0,0
TEENSY_3.1_ALLPINS = drill 0.965: 0 -7.62,15.24; 1 -7.62,12.7; 2 -7.62,10.16; 3 -7.62,7.62; 3.3V 7.62,12.7; 3.3V1 -2.54,-15.24; 3.3V2 2.54,0; 4 -7.62,5.08; 5 -7.62,2.54; 6 -7.62,0; 7 -7.62,-2.54; 8 -7.62,-5.08; 9 -7.62,-7.62; 10 -7.62,-10.16; 11 -7.62,-12.7; 12 -7.62,-15.24; 13 7.62,-15.24; 14/A0 7.62,-12.7; 15/A1 7.62,-10.16; 16/A2 7.62,-7.62; 17/A3 7.62,-5.08; 18/A4 7.62,-2.54; 19/A5 7.62,0; 20/A6 7.62,2.54; 21/A7 7.62,5.08; 22/A8 7.62,7.62; 23/A9 7.62,10.16; 24 0,-2.54; 25 0,-5.08; 26 0,-7.62; 27 0,-10.16; 28 0,-12.7; 29 2.54,-12.7; 30 2.54,-10.16; 31 2.54,-7.62; 32 2.54,-5.08; 33 2.54,-2.54; A10 5.08,7.62; A11 5.08,5.08; A12 0,2.54; A13 2.54,2.54; A14 5.08,-15.24; AGND 7.62,15.24; AREF 5.08,10.16; GND -7.62,17.78; GND1 0,-15.24; GND2 0,0; PGM 2.54,-15.24; VBAT -5.08,-15.24; VIN 7.62,17.78; VUSB 5.08,15.24
SO08 = smd 0.61 x 2.21: 1 -1.905,-2.616; 2 -0.635,-2.616; 3 0.635,-2.616; 4 1.905,-2.616; 5 1.905,2.616; 6 0.635,2.616; 7 -0.635,2.616; 8 -1.905,2.616
A4988CARRIER = drill 1: 1A 12.7,-10.16; 1B 12.7,-12.7; 2A 12.7,-7.62; 2B 12.7,-5.08; DIR 0,-17.78; EN 0,0; GND 12.7,-17.78; GND2 12.7,-2.54; MS1 0,-2.54; MS2 0,-5.08; MS3 0,-7.62; RESET 0,-10.16; SLEEP 0,-12.7; STEP 0,-15.24; VDD 12.7,-15.24; VMOT 12.7,0
NEOPIXEL_THT = drill 0.8: 5V -0.953,0; DIN -2.54,0; DOUT 2.223,0; GND 0.635,0
MOLEXPOWER = drill 1.6: P$1 -3.747,3.175; P$2 -3.747,0; P$3 3.747,0; P$4 3.747,3.175 | drill 2.8 octagon: P$5 8.496,-13.132; P$6 -8.496,-13.132
WTVO20SD-BRKKOUT = drill 0.9 pad 1.422: 3.3 0,0; BUSY -5.08,-17.78; DCLK -10.16,-17.78; DIN -7.62,-17.78; GND -2.54,0; NC -12.7,0; NEXT 0,-17.78; PLAY -2.54,-17.78; PREV -15.24,-17.78; PWMOUT -15.24,0; RESET -5.08,0; SPK+ -7.62,0; SPK- -10.16,0; VCC -12.7,-17.78

### Placement (x,y rotation side)
B1  85.41,63.82 90 top
B2  84.77,83.5 90 top
BAT1  74.3,46.04 180 top
C1  92.39,63.82 90 top
C2  92.39,83.5 270 top
C3  25.4,23.5 90 top
C5  46.67,84.45 90 top
C6  85.41,8.89 0 top
C7  85.41,3.17 0 top
C8  87,73.98 90 top
C9  38.42,61.91 270 top
C10  59.69,23.5 270 top
C11  85.41,20.32 0 top
C12  85.41,14.61 0 top
C13  85.41,31.75 0 top
C14  85.41,26.04 0 top
D1  41.59,66.36 270 top
D2  63.18,27.3 270 top
IC1  74.93,17.78 270 top
J1  24.77,3.81 180 top
J3  97.47,45.09 180 top
JP1  7.62,74.93 180 top
JP2  7.62,69.85 180 top
JP3  30.8,66.67 0 top
JP4  52.07,28.26 0 top
JP5  22.86,69.85 180 top
JP6  22.86,66.04 180 top
JP7  22.86,73.66 180 top
JP8  94.93,6.67 0 top
JP9  94.93,26.04 0 top
JP10  94.93,20.32 0 top
JP11  94.93,14.61 0 top
JP12  94.93,31.43 0 top
JP13  22.86,62.23 180 top
JP14  35.56,3.81 0 top
JP15  3.81,57.15 90 top
JP16  7.3,3.81 0 top
JP17  98.11,62.55 90 top
JP18  98.11,82.23 90 top
JP19  3.17,90.81 90 top
JP20  49.85,48.26 270 top
Q1  24.77,12.38 180 top
Q2  65.72,62.23 270 top
Q3  64.14,84.45 270 top
R1  61.59,62.23 270 top
R2  68.9,62.23 90 top
R3  60.64,84.45 270 top
R4  67.63,84.45 270 top
R5  39.69,84.45 90 top
R6  8.57,82.87 270 top
R7  10.79,82.87 90 top
R8  90.81,8.89 180 top
R9  90.81,3.17 180 top
R10  90.81,20.32 180 top
R11  90.81,14.61 180 top
R12  90.81,31.43 180 top
R13  90.81,25.72 180 top
R14  24.77,15.56 0 top
R15  41.59,60.96 90 top
R16  63.18,22.54 90 top
S2  4.45,82.55 90 top
SJ1  51.12,39.05 0 top
STANDOFF1  2.86,2.54 0 top
STANDOFF2  99.06,2.54 0 top
STANDOFF4  99.06,98.11 0 top
STANDOFF6  2.86,98.74 0 top
U1  54.29,73.03 270 top
U$1  71.12,73.34 270 top
U$2  22.23,45.09 90 top
U$3  91.44,73.98 0 top
U$4  5.08,27.94 0 top
U$5  33.02,27.94 0 top
U$6  40.32,95.89 90 top
U$7  52.7,95.89 90 top
U$8  65.09,95.89 90 top
U$9  21.91,85.41 180 top
U$10  77.47,95.89 90 top
U$11  89.85,95.89 90 top
U$12  68.26,36.2 180 top

### Tracks (layer width: path | path; a pad name or v marks a point on that pad's centre or on a via)
3.3V
  Bottom 0.254: U$2.3.3V2 22.23,47.31 23.5,46.04 23.5,42.86 23.81,42.55
  Bottom 0.406: U$2.3.3V1 23.81,42.55 11.75,42.55 9.53,44.77 U$2.3.3V
+3V3  (via drill 0.6)
  Top 0.254: 59.5,25.08 C10.1 | 97.47,14.43 JP11.2 | 51.44,76.89 U1.1 | v10.79,79.38 R7.1 9.1,83.72 R6.1 | JP4.4 59.69,28.89 | IC1.14 79.06,25.4 82.23,28.57 95.11,28.57 JP9.2 | 52.7,38.99 SJ1.3
  Top 0.406: JP13.2 JP6.2 JP5.2 JP7.2 | D2.A 62.51,28.13 JP4.4 C10.1 | U$5.VDD 46.35,12.7 47.62,13.97 47.62,23.81 48.9,25.08 59.5,25.08 | 97.47,14.43 JP8.P$4 JP8.P$3 92.39,1.59 71.44,1.59 69.22,3.81 69.22,10.48 66.99,12.7 66.99,19.37 65.72,20.64 65.72,28.89 64.45,30.16 60.96,30.16 59.69,28.89 | JP11.2 JP10.2 JP9.2 JP12.2 | U$6.5V 44.77,94.93 46.67,93.03 C5.+ 49.73,88.7 51.44,87 51.44,76.89 | U1.1 53.66,76.83 54.29,76.2 54.29,65.09 60.01,59.37 75.56,59.37 U$12.VCC 79.69,52.7 77.79,52.7 75.56,50.48 57.15,50.48 55.24,48.58 55.24,41.66 SJ1.3 | v52.7,36.2 52.7,38.99
  Bottom 0.254: 20.64,74.23 JP7.2 | JP4.4 59.69,29.21
  Bottom 0.406: U$5.VDD 35.24,12.7 33.97,11.43 19.05,11.43 U$4.VDD | U$11.5V U$10.5V U$8.5V U$7.5V U$6.5V 22.54,94.93 20.64,93.03 20.64,76.83 | 20.64,76.83 18.1,79.38 v10.79,79.38 9.27,79.38 JP1.2 | 20.64,76.83 20.64,74.23 | 59.69,29.21 v52.7,36.2
+5V  (via drill 0.6)
  Top 0.254: U$3.8 88.51,76.59 88.27,76.83 v65.41,76.83 | R2.2 68.68,63.08 66.67,65.09 | 66.67,65.09 U$1.12 | JP2.2 5.08,68.9 | R4.1 66.78,85.31 v65.41,86.68 | v57.15,79.38 57.15,76.89 U1.14 | D1.A v41.59,69.85 | v65.41,64.77 66.36,64.77 66.67,65.09 | SJ1.1 49.59,36.89 v49.53,36.83
  Top 0.406: JP3.4 40.28,66.55 D1.A | C9.1 JP3.4 | U$2.VIN 1.59,55.56 1.59,65.41 5.08,68.9 v5.08,66.99 | v22.86,59.37 35.88,59.37 36.51,60.01 36.51,64.64 JP3.4
  Bottom 0.254: v65.41,86.68 v65.41,76.83 | v65.41,76.83 59.69,76.83 v57.15,79.38 46.35,79.38 41.59,74.61 v41.59,69.85 | v65.41,76.83 v65.41,64.77 | v49.53,36.83 40.96,36.83 39.05,38.73 6.35,38.73 4.45,40.64 U$2.VIN
  Bottom 0.406: v5.08,66.99 6.67,65.09 8.57,63.18 12.38,63.18 16.51,59.37 v22.86,59.37
+24V  (via drill 0.6)
  Top 0.254: v79.69,85.09 81.44,85.09 B2.+ | B1.+ 80.67,65.12 v80.64,65.09 | J1.2 24.13,7.94
  Top 0.406: 24.13,7.94 22.86,9.21 22.86,16.19 23.81,17.14 25.72,17.14 26.67,16.19 28.57,16.19 29.53,17.14 29.53,26.99 29.21,27.3 25.72,27.3 25.4,26.99 C3.+
  Top 0.813: U$1.6 v70.48,81.92
  Bottom 0.254: 70.48,82.55 v70.48,81.92 70.8,82.23 70.48,82.55 | 70.48,82.55 70.48,84.45 71.12,85.09 v79.69,85.09 | v80.64,65.09 70.8,65.09 70.48,64.77 | C3.+ 25.4,26.35 | 25.59,58.1 25.65,58.17 | 33.34,57.47 33.02,57.15 | U$4.VMOT 17.78,28.26
  Bottom 0.813: 25.65,58.17 26.67,57.15 33.02,57.15 68.9,57.15 70.48,58.74 70.48,64.77 v70.48,81.92 | 25.59,58.1 16.19,58.1 12.06,62.23 JP15.3 1.59,60.13 1.59,33.02 4.13,30.48 15.56,30.48 17.78,28.26 | JP3.2 33.34,57.47 | JP4.2 54.61,29.21 53.66,30.16 47.94,30.16 U$5.VMOT 44.13,30.16 28.26,30.16 25.4,27.3 C3.+ 23.5,27.94 U$4.VMOT | U$9.P$2 25.72,85.72 25.72,82.61 U$9.P$1
  Bottom 1.27: U$9.P$1 25.65,58.17
DIR1
  Top 0.254: U$5.DIR 32.07,10.16 30.8,11.43 30.8,28.26 26.04,33.02 25.08,33.02 23.81,34.29 22.86,34.29 21.59,35.56 19.68,35.56 18.73,36.51 18.1,36.51 U$2.4
DIR2
  Top 0.254: U$4.DIR 4.13,10.16 3.17,11.11 3.17,34.92 4.13,35.88 6.67,35.88 6.99,36.2 U$2.0
DIRA
  Top 0.254: U$2.15/A1 32.38,56.52 33.02,57.15 46.04,57.15 47.31,58.42 47.31,73.66 47.94,74.3 U1.3
DIRB
  Top 0.254: U$2.14/A0 34.92,55.56 35.24,55.88 46.67,55.88 48.58,57.78 48.58,71.44 48.9,71.75 U1.5
ENS1
  Top 0.254: U$5.EN 33.02,29.21 32.07,30.16 30.8,30.16 26.67,34.29 25.72,34.29 24.45,35.56 23.81,35.56 22.54,36.83 22.54,37.15 U$2.6
ENS2
  Top 0.254: U$4.EN 5.08,28.26 4.45,28.89 4.45,34.29 4.76,34.61 9.21,34.61 10.48,35.88 11.75,35.88 12.06,36.2 U$2.2
FAN
  Top 0.254: Q1.1 25.41,15.31 R14.2 28.89,15.56 30.16,16.83 30.16,27.94 25.72,32.38 24.77,32.38 23.5,33.66 22.54,33.66 21.27,34.92 19.37,34.92 18.41,35.88 16.19,35.88 U$2.3
GND  (via drill 0.6)
  Top 0.254: C5.- v46.67,77.15 | U1.7 51.49,67.05 v51.44,66.99 | C6.- 83.61,8.68 v85.41,10.16 | 76.83,62.87 v76.83,63.18 U$1.20 | U$1.1 76.83,82.55 v77.15,82.87 | Q2.2 63.81,61.28 62.87,62.23 59.69,62.23
  Bottom 0.254: v85.41,10.16 86.04,10.16 82.87,6.67 | v77.15,82.87 77.47,82.87 79.06,81.28 | v76.83,63.18 77.47,63.18 77.79,62.87
  other vias: 61.59,66.67 67.94,75.25 67.94,73.98 67.94,72.71 67.94,71.44 69.22,71.44 69.22,72.71 69.22,73.98 69.22,75.25 71.75,75.25 71.75,73.98 71.75,72.71 71.75,71.44 73.03,75.25 73.03,73.98 73.03,72.71 73.03,71.44 74.3,75.25 74.3,73.98 74.3,72.71 74.3,71.44
  pour Top (isolate 0.305, rank 6): -15.88,119.38 -15.88,-8.26 110.49,-8.26 110.49,120.65 -15.88,120.65
  pour Bottom (isolate 0.305, rank 6): -19.37,110.49 -19.37,-13.65 123.83,-13.65 123.83,-9.84 120.65,-9.84 120.65,118.75 -19.37,118.75
LEDS
  Top 0.254: U$2.16/A2 29.84,57.15 31.11,58.42 45.4,58.42 46.04,59.05 46.04,74.93 45.4,75.56 40.32,75.56 39.69,76.2 R5.1
LIGHT
  Top 0.254: JP15.4 8.57,64.77 11.43,61.91 11.43,53.34 U$2.23/A9
LS1
  Top 0.254: IC1.6 69.22,12.7 68.26,13.65 68.26,20 66.99,21.27 66.99,29.53 65.09,31.43 31.43,31.43 27.3,35.56 26.35,35.56 25.08,36.83 25.08,37.15 U$2.7
LS2
  Top 0.254: IC1.8 73.03,10.16 71.75,11.43 69.22,11.43 67.63,13.02 67.63,19.68 66.36,20.95 66.36,29.21 64.77,30.8 31.11,30.8 26.99,34.92 26.04,34.92 24.77,36.2 24.13,36.2 23.5,36.83 23.5,43.81 U$2.24
LS3
  Top 0.254: IC1.4 69.85,17.78 69.53,18.1 69.53,20.64 68.26,21.91 68.26,30.16 65.72,32.7 32.07,32.7 U$2.8
LS4
  Top 0.254: IC1.10 73.34,15.24 72.07,13.97 69.85,13.97 68.9,14.92 68.9,20.32 67.63,21.59 67.63,29.84 65.41,32.07 31.75,32.07 27.62,36.2 26.67,36.2 26.04,36.83 26.04,41.59 29.53,45.09 U$2.26
LS5
  Top 0.254: IC1.2 69.85,22.86 69.53,23.18 69.53,30.8 66.36,33.97 32.7,33.97 29.84,36.83 U$2.9
LS6
  Top 0.254: IC1.12 73.03,20.32 71.75,21.59 69.53,21.59 68.9,22.23 68.9,30.48 66.04,33.34 32.38,33.34 28.57,37.15 28.57,41.27 U$2.27
MISO
  Top 0.254: U$2.12 37.47,36.83 37.78,36.51 45.4,36.51 46.35,37.47 46.35,46.99 47.62,48.26 JP20.P$1
MOSI
  Top 0.254: U$2.11 34.92,37.15 35.88,35.88 45.72,35.88 46.99,37.15 46.99,43.18 48.26,44.45 51.12,44.45 JP20.P$4
N1
  Top 0.254: IC1.5 71.44,15.24 72.39,16.19 80.33,16.19 80.96,15.56 80.96,5.4 81.6,4.76 86.36,4.76 87.31,5.71 C6.+ 87.51,8.89 R8.2
N2
  Top 0.254: R9.2 87.51,3.17 C7.+ 86.16,4.13 81.28,4.13 80.33,5.08 80.33,12.06 79.69,12.7 IC1.9
N3
  Top 0.254: R10.2 87.51,20.32 C11.+ 86.24,19.05 72.07,19.05 71.12,20 IC1.3
N5
  Top 0.254: R12.2 87.42,31.43 C13.+ 87.31,29.84 86.68,29.21 81.92,29.21 79.38,26.67 72.71,26.67 71.44,25.4 IC1.1
N6
  Top 0.254: R13.2 87.42,25.72 C14.+ 87.31,27.3 86.68,27.94 82.55,27.94 80.33,25.72 80.33,23.5 79.69,22.86 IC1.13
N$1
  Top 0.254: 92.09,84.8 C2.1
  Top 0.406: 97.9,85.1 JP18.2
  Top 0.813: C2.1 97.9,85.1 | U$1.4 73.03,84.77 74.93,86.68 85.95,86.68 B2.~2 92.09,84.8
N$2
  Top 0.254: 87.95,82.08 B2.~1 | 92.22,82.08 C2.2
  Top 0.406: 97.9,81.9 JP18.1
  Top 0.813: C2.2 97.9,81.9 | U$1.5 71.75,78.74 72.71,77.79 86.68,77.79 87.95,79.06 87.95,82.08 92.22,82.08
N$3
  Top 0.254: 92.09,62.52 C1.1
  Top 0.406: 97.9,62.22 JP17.1
  Top 0.813: C1.1 97.9,62.22 | U$1.17 73.03,62.23 74.93,60.33 86.27,60.33 B1.~1 92.09,62.52
N$4
  Top 0.254: U$1.16 71.75,67.63 | B1.~2 88.58,65.24 88.42,65.24 88.27,65.09 | 92.06,65.09 C1.2
  Top 0.406: 97.9,65.42 JP17.2
  Top 0.813: C1.2 97.9,65.42 | 71.75,67.63 72.71,68.58 87.31,68.58 88.58,67.31 88.58,65.24 | 88.27,65.09 92.06,65.09
N$5
  Top 0.254: U1.11 57.78,73.03 62.23,68.58 68.58,68.58 69.22,67.94 U$1.14
N$6
  Top 0.254: R1.2 62.23,61.28 63.5,60.01 | 63.5,60.01 69.85,60.01 70.8,60.96 70.8,64.45 70.48,64.77 U$1.15 | U1.10 55.24,71.75 54.93,71.44 54.93,65.41 60.33,60.01 63.5,60.01
N$7
  Top 0.254: U1.13 57.78,75.56 58.42,76.2 58.42,85.41 60.64,87.63 67.94,87.63 69.22,86.36 69.22,82.87 67.94,81.6 U$1.8
N$8
  Top 0.254: R3.2 59.05,81.97 59.05,75.56 57.78,74.3 U1.12 56.2,74.3 55.56,74.93 55.56,77.15 55.88,77.47 55.88,83.82 60.64,88.27 68.26,88.27 69.85,86.68 69.85,82.87 69.22,82.23 U$1.7
N$9
  Top 0.254: R1.1 64.57,63.13 Q2.1
N$10
  Top 0.254: Q2.3 66.99,62.23 67.94,61.28 68.8,61.28 R2.1 69,61.28 69.85,61.28 70.17,61.59 70.17,63.82 69.53,64.45 68.26,64.45 67.94,64.77 U$1.13
N$11
  Top 0.254: R3.1 62.98,85.36 Q3.1
N$12
  Top 0.254: Q3.3 66.78,84.45 R4.2 67.63,82.55 66.67,81.6 U$1.9
N$13
  Top 1.27: U$5.2B 36.83,22.86 35.56,21.59 JP14.1
N$14
  Top 1.27: U$5.2A 39.37,20.32 38.1,19.05 JP14.2
N$15
  Top 1.27: U$5.1A 41.91,17.78 40.64,16.51 JP14.3
N$16
  Top 1.27: U$5.1B 44.45,15.24 43.18,13.97 JP14.4
N$17
  Top 1.27: U$4.2B 8.89,22.86 7.3,21.27 JP16.1
N$18
  Top 1.27: U$4.2A 11.43,20.32 9.84,18.73 JP16.2
N$19
  Top 1.27: U$4.1A 13.34,17.78 12.38,16.83 JP16.3
N$20
  Top 1.27: U$4.1B 16.83,15.24 15.88,15.24 14.92,14.29 JP16.4
N$21
  Top 0.254: R11.2 87.51,14.61 C12.+ 87.31,17.47 86.36,18.41 79.38,18.41 IC1.11
N$22
  Top 0.254: R10.1 JP10.1
N$23
  Top 0.406: U$5.RESET U$5.SLEEP
N$24
  Top 0.254: U$4.RESET U$4.SLEEP
N$25
  Top 0.254: R11.1 JP11.1
N$27
  Top 0.254: R12.1 JP12.1
N$29
  Top 0.254: U$6.DOUT 47.94,98.11 U$7.DIN
N$30
  Top 0.254: U$8.DOUT 72.71,98.11 U$10.DIN
N$31
  Top 0.254: U$6.DIN 40.32,93.03 39.69,92.39 R5.2
N$32
  Top 0.254: U$7.DOUT 60.33,98.11 U$8.DIN
N$33
  Top 0.254: Q1.3 25.05,11.46
  Top 0.406: 25.05,11.46 25.4,11.11 J1.1
N$34
  Top 0.254: R8.1 94.61,8.89 JP8.P$2
N$35
  Top 0.254: R9.1 91.44,3.17 JP8.P$1
N$36
  Top 0.254: R13.1 94.44,25.72 JP9.1
N$38
  Top 0.254: U$10.DOUT 85.09,98.11 U$11.DIN
N$39
  Top 0.406: J3.SLEEVE 87.31,45.09 U$12.SPK-
N$40  (1 unrouted)
  Bottom 0.406: J3.RING 79.77,40.09 75.56,35.88
N$49
  Top 0.406: D1.C R15.2
N$50
  Top 0.406: D2.C R16.2
PIR
  Top 0.254: JP1.1 7.62,73.34 6.35,72.07 6.35,67.94 12.06,62.23 12.06,54.93 13.34,53.66 13.34,51.44 U$2.A10
POT1
  Top 0.254: JP7.3 14.61,71.12 14.61,56.2 16.83,53.98 18.41,53.98 U$2.20/A6
POT2
  Top 0.254: JP5.3 15.24,67.63 15.24,56.52 17.14,54.61 20.32,54.61 U$2.19/A5
POT3
  Top 0.254: JP6.3 15.88,64.77 15.88,56.83 17.46,55.24 22.23,55.24 U$2.18/A4
POT4
  Top 0.254: JP13.3 16.51,61.59 16.51,57.15 17.78,55.88 24.13,55.88 U$2.17/A3
PWMA
  Top 0.254: U$2.32 27.3,48.26 31.11,52.07 31.11,57.15 31.75,57.78 45.72,57.78 46.67,58.74 46.67,74.93 47.31,75.56 U1.2
PWMB
  Top 0.254: U$2.25 28.57,46.35 28.57,48.58 31.11,51.12 33.02,51.12 33.66,51.75 33.66,55.88 34.29,56.52 46.35,56.52 47.94,58.1 47.94,72.39 48.58,73.03 U1.4
S_BUSY
  Top 0.254: U$12.BUSY 73.34,53.66 72.07,52.39 42.55,52.39 41.59,51.44 37.15,51.44 35.56,49.85 32.07,49.85 U$2.31
S_DCLK
  Top 0.254: U$12.DCLK 77.47,53.98 74.61,51.12 43.18,51.12 38.42,46.35 36.2,46.35 U$2.29
S_DIN
  Top 0.254: U$12.DIN 73.66,51.75 42.86,51.75 40.01,48.9 33.66,48.9 U$2.30
S_RESET
  Top 0.254: U$12.RESET 73.34,35.88 72.07,34.61 33.02,34.61 31.11,36.51 31.11,41.27 U$2.28
SCK
  Bottom 0.254: U$2.13 37.15,52.7 34.92,50.48 34.92,49.53 35.56,48.9 46.67,48.9 JP20.P$3
SERVO
  Top 0.254: JP2.1 10.79,66.67 10.79,64.45 12.7,62.55 12.7,55.24 14.61,53.34 U$2.22/A8
SS
  Top 0.254: U$2.10 32.38,36.51 33.66,35.24 46.04,35.24 47.62,36.83 47.62,42.55 48.26,43.18 JP20.P$5
STEP1
  Top 0.254: U$5.STEP 32.38,12.7 31.43,13.65 31.43,28.57 26.35,33.66 25.4,33.66 24.13,34.92 23.18,34.92 21.91,36.2 20.95,36.2 U$2.5
STEP2
  Top 0.254: U$4.STEP 4.76,12.7 3.81,13.65 3.81,34.61 4.45,35.24 8.89,35.24 9.53,35.88 U$2.1
SW1
  Top 0.254: JP19.2 8.71,93.52 10.79,91.44 R7.2 10.9,83.72 12.06,82.55 12.06,65.09 13.97,63.18 13.97,55.88 U$2.21/A7
SW2
  Top 0.254: U$2.A11 15.88,51.12 15.88,53.02 13.34,55.56 13.34,62.87 11.43,64.77 11.43,74.99 7.12,79.3 S2.3 8.57,81.17 R6.2
TEMPSENSE  (via drill 0.6)
  Top 0.254: U$3.1 88.21,71.36 C8.1 79.56,72.58 76.52,69.53 65.09,69.53 v64.45,70.17 | v39.69,54.61 40.32,55.24 46.99,55.24 49.21,57.47 49.21,69.85 v49.53,70.17
  Bottom 0.254: v64.45,70.17 v49.53,70.17 | v39.69,54.61 39.69,50.48 39.37,50.16 U$2.A14
VBAT
  Bottom 0.254: U$2.VBAT 56.41,40.01 BAT1.1
VTG
  Top 0.254: SJ1.2 51.12,40.32 51.75,40.96 53.02,40.96 54.61,42.55 54.61,46.04 JP20.P$2

### Text on the board
tPlace: +24V | ICSP | +5 | +3 | Wing Top | Wing Bot | Neck Top | Neck Bot | W. Prescott | L | Fall 2014
tNames: DC 2 | - | + | SIG | SIG | + | - | - | + | SIG | DC 1 | SIG | +24 | PWR | GND | +24 | _ | SIG | + | Stepper 1 | Stepper 2